# Altium project FDTI_USB_V1_1.PrjPcb
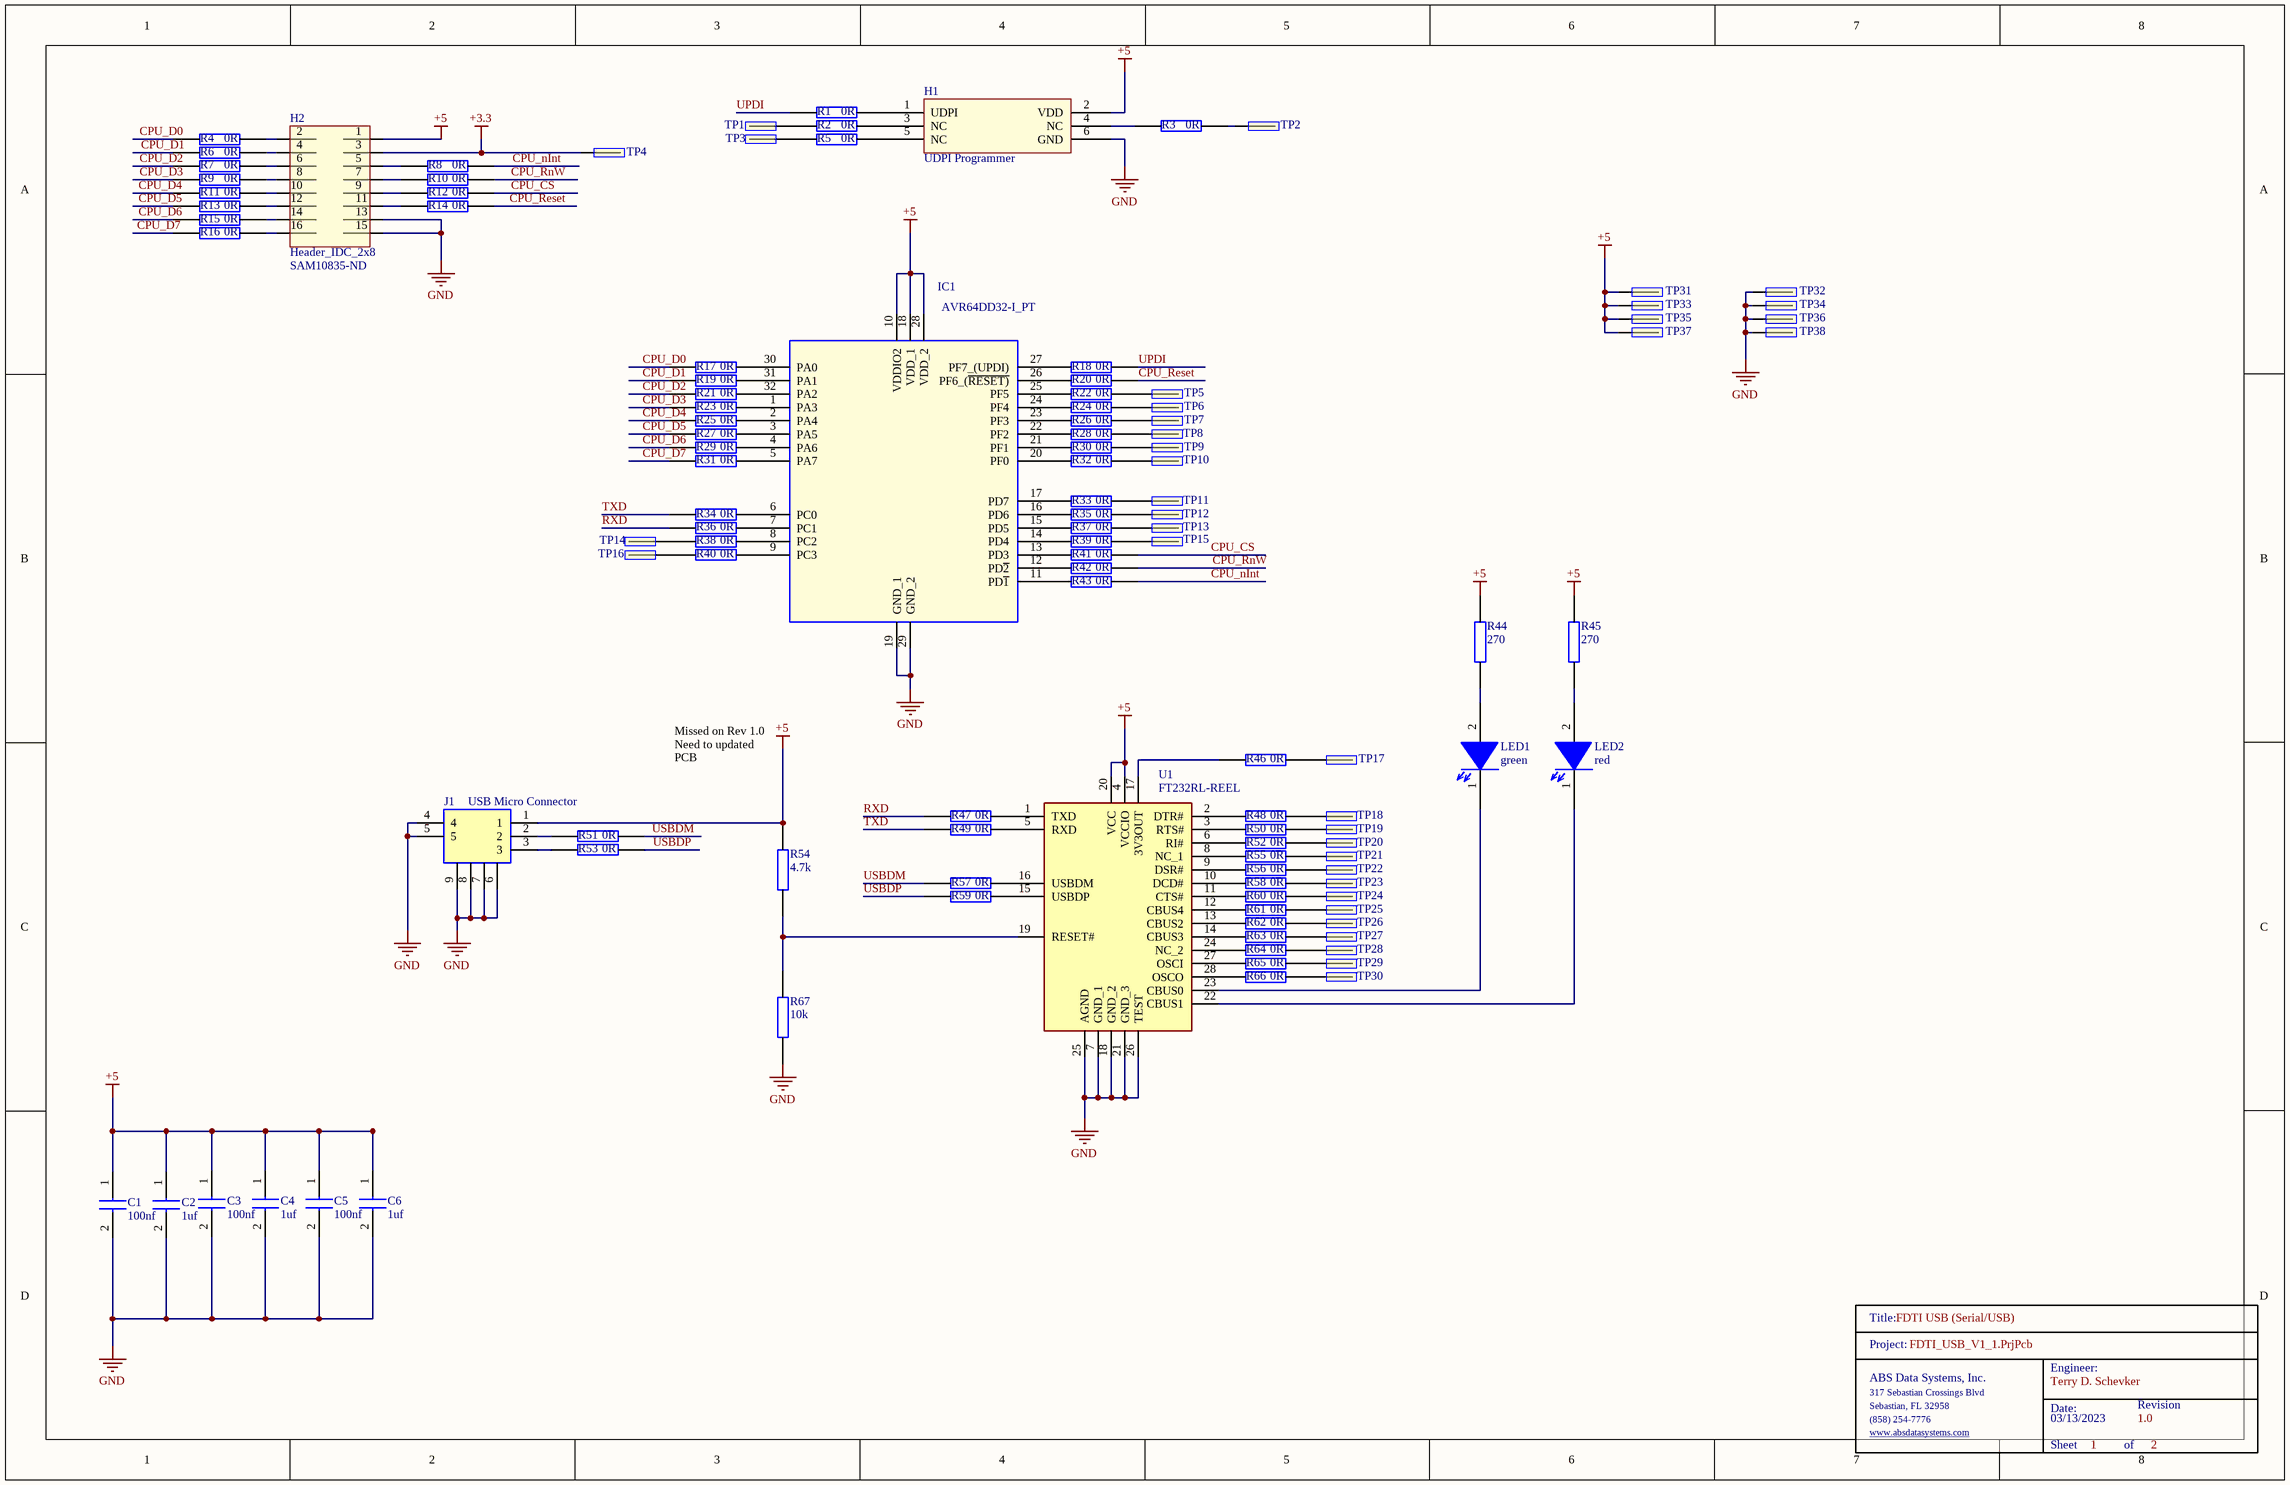
[diagram p0: FDTI_USB_Card.SchDoc]
2 sheets, 168 parts. Net scope: global (net labels, ports and power ports of the same name join across sheets).
Board file: FDTI_USB_PCB.PcbDoc
Sheets:
  FDTI_USB_Card.SchDoc
  FDTI_LED_Monitor.SchDoc

## Sheet FDTI_USB_Card.SchDoc: FDTI USB (Serial/USB)
size Tabloid; Date: 03/13/2023; Engineer: Terry D. Schevker; Revision: 1.0; SheetNumber: 1; SheetTotal: 2

### Parts
C1  100nf  [0603]
C2  1uf  [0603]
C3  100nf  [0603]
C4  1uf  [0603]
C5  100nf  [0603]
C6  1uf  [0603]
H1  UDPI Programmer  [HDR2X3]
H2  Header_IDC_2x8  Supplier Part Number 1: SAM10835-ND  [HEADER16]
IC1  AVR64DD32-I_PT  [QFP80P900X900X120-32N]
J1  USB Micro Connector  [1734035-2USB]
LED1  green  [0603_Diode]
LED2  red  [0603_Diode]
R1  0R  [0603]
R2  0R  [0603]
R3  0R  [0603]
R4  0R  [0603]
R5  0R  [0603]
R6  0R  [0603]
R7  0R  [0603]
R8  0R  [0603]
R9  0R  [0603]
R10  0R  [0603]
R11  0R  [0603]
R12  0R  [0603]
R13  0R  [0603]
R14  0R  [0603]
R15  0R  [0603]
R16  0R  [0603]
R17  0R  [0603]
R18  0R  [0603]
R19  0R  [0603]
R20  0R  [0603]
R21  0R  [0603]
R22  0R  [0603]
R23  0R  [0603]
R24  0R  [0603]
R25  0R  [0603]
R26  0R  [0603]
R27  0R  [0603]
R28  0R  [0603]
R29  0R  [0603]
R30  0R  [0603]
R31  0R  [0603]
R32  0R  [0603]
R33  0R  [0603]
R34  0R  [0603]
R35  0R  [0603]
R36  0R  [0603]
R37  0R  [0603]
R38  0R  [0603]
R39  0R  [0603]
R40  0R  [0603]
R41  0R  [0603]
R42  0R  [0603]
R43  0R  [0603]
R44  270  [0603]
R45  270  [0603]
R46  0R  [0603]
R47  0R  [0603]
R48  0R  [0603]
R49  0R  [0603]
R50  0R  [0603]
R51  0R  [0603]
R52  0R  [0603]
R53  0R  [0603]
R54  4.7k  [0603]
R55  0R  [0603]
R56  0R  [0603]
R57  0R  [0603]
R58  0R  [0603]
R59  0R  [0603]
R60  0R  [0603]
R61  0R  [0603]
R62  0R  [0603]
R63  0R  [0603]
R64  0R  [0603]
R65  0R  [0603]
R66  0R  [0603]
R67  10k  [0603]
TitleBlock_1  TitleBlock  (value not drawn)  (graphical)
TP1  TP  [TP]  (value not drawn)
TP2  TP  [TP]  (value not drawn)
TP3  TP  [TP]  (value not drawn)
TP4  TP  [TP]  (value not drawn)
TP5  TP  [TP]  (value not drawn)
TP6  TP  [TP]  (value not drawn)
TP7  TP  [TP]  (value not drawn)
TP8  TP  [TP]  (value not drawn)
TP9  TP  [TP]  (value not drawn)
TP10  TP  [TP]  (value not drawn)
TP11  TP  [TP]  (value not drawn)
TP12  TP  [TP]  (value not drawn)
TP13  TP  [TP]  (value not drawn)
TP14  TP  [TP]  (value not drawn)
TP15  TP  [TP]  (value not drawn)
TP16  TP  [TP]  (value not drawn)
TP17  TP  [TP]  (value not drawn)
TP18  TP  [TP]  (value not drawn)
TP19  TP  [TP]  (value not drawn)
TP20  TP  [TP]  (value not drawn)
TP21  TP  [TP]  (value not drawn)
TP22  TP  [TP]  (value not drawn)
TP23  TP  [TP]  (value not drawn)
TP24  TP  [TP]  (value not drawn)
TP25  TP  [TP]  (value not drawn)
TP26  TP  [TP]  (value not drawn)
TP27  TP  [TP]  (value not drawn)
TP28  TP  [TP]  (value not drawn)
TP29  TP  [TP]  (value not drawn)
TP30  TP  [TP]  (value not drawn)
TP31  TP  [TP]  (value not drawn)
TP32  TP  [TP]  (value not drawn)
TP33  TP  [TP]  (value not drawn)
TP34  TP  [TP]  (value not drawn)
TP35  TP  [TP]  (value not drawn)
TP36  TP  [TP]  (value not drawn)
TP37  TP  [TP]  (value not drawn)
TP38  TP  [TP]  (value not drawn)
U1  FT232RL-REEL  [SOIC-28_Narrow]

### Nets
+3.3: H2.3 TP4.1
+5: C1.1 C2.1 C3.1 C4.1 C5.1 C6.1 H1.2(VDD) H2.1 IC1.10(VDDIO2) IC1.18(VDD_1) IC1.28(VDD_2) J1.1 R44.2 R45.2 R54.2 TP31.1 TP33.1 TP35.1 TP37.1 U1.4(VCCIO) U1.20(VCC)
GND: C1.2 C2.2 C3.2 C4.2 C5.2 C6.2 H1.6(GND) H2.13 H2.15 IC1.19(GND_1) IC1.29(GND_2) J1.4 J1.5 J1.6(Shield) J1.7(Shield) J1.8(Shield) J1.9(Shield5) R67.1 TP32.1 TP34.1 TP36.1 TP38.1 U1.7(GND_1) U1.18(GND_2) U1.21(GND_3) U1.25(AGND) U1.26(TEST)
CPU_CS: R12.2 R41.2
CPU_D0: R4.1 R17.1
CPU_D1: R6.1 R19.1
CPU_D2: R7.1 R21.1
CPU_D3: R9.1 R23.1
CPU_D4: R11.1 R25.1
CPU_D5: R13.1 R27.1
CPU_D6: R15.1 R29.1
CPU_D7: R16.1 R31.1
CPU_nInt: R8.2 R43.2
CPU_Reset: R14.2 R20.2
CPU_RnW: R10.2 R42.2
RXD: R36.1 R47.1
TXD: R34.1 R49.1
UPDI: R1.1 R18.2
USBDM: R51.2 R57.1
USBDP: R53.2 R59.1
NetH1_1: H1.1(UDPI) R1.2
NetH1_3: H1.3(NC) R2.2
NetH1_4: H1.4(NC) R3.1
NetH1_5: H1.5(NC) R5.2
NetH2_2: H2.2 R4.2
NetH2_4: H2.4 R6.2
NetH2_5: H2.5 R8.1
NetH2_6: H2.6 R7.2
NetH2_7: H2.7 R10.1
NetH2_8: H2.8 R9.2
NetH2_9: H2.9 R12.1
NetH2_10: H2.10 R11.2
NetH2_11: H2.11 R14.1
NetH2_12: H2.12 R13.2
NetH2_14: H2.14 R15.2
NetH2_16: H2.16 R16.2
NetIC1_1: IC1.1(PA3) R23.2
NetIC1_2: IC1.2(PA4) R25.2
NetIC1_3: IC1.3(PA5) R27.2
NetIC1_4: IC1.4(PA6) R29.2
NetIC1_5: IC1.5(PA7) R31.2
NetIC1_6: IC1.6(PC0) R34.2
NetIC1_7: IC1.7(PC1) R36.2
NetIC1_8: IC1.8(PC2) R38.2
NetIC1_9: IC1.9(PC3) R40.2
NetIC1_11: IC1.11(PD~{1}) R43.1
NetIC1_12: IC1.12(PD~{2}) R42.1
NetIC1_13: IC1.13(PD3) R41.1
NetIC1_14: IC1.14(PD4) R39.1
NetIC1_15: IC1.15(PD5) R37.1
NetIC1_16: IC1.16(PD6) R35.1
NetIC1_17: IC1.17(PD7) R33.1
NetIC1_20: IC1.20(PF0) R32.1
NetIC1_21: IC1.21(PF1) R30.1
NetIC1_22: IC1.22(PF2) R28.1
NetIC1_23: IC1.23(PF3) R26.1
NetIC1_24: IC1.24(PF4) R24.1
NetIC1_25: IC1.25(PF5) R22.1
NetIC1_26: IC1.26(PF6_(~{RESET)}) R20.1
NetIC1_27: IC1.27(PF7_(UPDI)) R18.1
NetIC1_30: IC1.30(PA0) R17.2
NetIC1_31: IC1.31(PA1) R19.2
NetIC1_32: IC1.32(PA2) R21.2
NetJ1_2: J1.2 R51.1
NetJ1_3: J1.3 R53.1
NetLED1_1: LED1.1(K) U1.23(CBUS0)
NetLED1_2: LED1.2(A) R44.1
NetLED2_1: LED2.1(K) U1.22(CBUS1)
NetLED2_2: LED2.2(A) R45.1
NetR2_1: R2.1 TP1.1
NetR3_2: R3.2 TP2.1
NetR5_1: R5.1 TP3.1
NetR22_2: R22.2 TP5.1
NetR24_2: R24.2 TP6.1
NetR26_2: R26.2 TP7.1
NetR28_2: R28.2 TP8.1
NetR30_2: R30.2 TP9.1
NetR32_2: R32.2 TP10.1
NetR33_2: R33.2 TP11.1
NetR35_2: R35.2 TP12.1
NetR37_2: R37.2 TP13.1
NetR38_1: R38.1 TP14.1
NetR39_2: R39.2 TP15.1
NetR40_1: R40.1 TP16.1
NetR46_1: R46.1 U1.17(3V3OUT)
NetR46_2: R46.2 TP17.1
NetR47_2: R47.2 U1.1(TXD)
NetR48_1: R48.1 U1.2(DTR#)
NetR48_2: R48.2 TP18.1
NetR49_2: R49.2 U1.5(RXD)
NetR50_1: R50.1 U1.3(RTS#)
NetR50_2: R50.2 TP19.1
NetR52_1: R52.1 U1.6(RI#)
NetR52_2: R52.2 TP20.1
NetR54_1: R54.1 R67.2 U1.19(RESET#)
NetR55_1: R55.1 U1.8(NC_1)
NetR55_2: R55.2 TP21.1
NetR56_1: R56.1 U1.9(DSR#)
NetR56_2: R56.2 TP22.1
NetR57_2: R57.2 U1.16(USBDM)
NetR58_1: R58.1 U1.10(DCD#)
NetR58_2: R58.2 TP23.1
NetR59_2: R59.2 U1.15(USBDP)
NetR60_1: R60.1 U1.11(CTS#)
NetR60_2: R60.2 TP24.1
NetR61_1: R61.1 U1.12(CBUS4)
NetR61_2: R61.2 TP25.1
NetR62_1: R62.1 U1.13(CBUS2)
NetR62_2: R62.2 TP26.1
NetR63_1: R63.1 U1.14(CBUS3)
NetR63_2: R63.2 TP27.1
NetR64_1: R64.1 U1.24(NC_2)
NetR64_2: R64.2 TP28.1
NetR65_1: R65.1 U1.27(OSCI)
NetR65_2: R65.2 TP29.1
NetR66_1: R66.1 U1.28(OSCO)
NetR66_2: R66.2 TP30.1

### Notes on the sheet
- Missed on Rev 1.0
  Need to updated PCB
- (in symbol TitleBlock) Title:; Project:; Engineer:; ABS Data Systems, Inc.; 317 Sebastian Crossings Blvd; Sebastian, FL 32958; Date:; Revision; (858) 254-7776; www.absdatasystems.com; Sheet; of

### Library data of the parts
C1 C3 C5 = CL10B104JB8NNNC: Samsung Electro-Mechanics 0603 100nf
C2 C4 C6 = CL10B105KA8NNNL: Samsung Electro-Mechanics 0603 1uf
H1 = UDPI Programmer: 6 Pin 2X3 Through Hole Header
H2 = Header_IDC_2x8: 16 Pin 2x8 Through Hold IDC Connector; Manufacturer: Samtec; Manufacturer Part Number: TST-108-01-G-D; Number of Contacts: 16; Gender: Male; Connector Type: Male Pin; Pitch: 2.54mm; Row Spacing: 0.1inch; Supplier 1: Digi-Key; RoHS: Yes; Category: Headers and Wire Housings; Stock 1: 227; Pricing 1: 1=2.85000, 10=2.73600, 100=2.28000, 500=1.93800, 1000=1.65300, 5000=1.48200 (USD); Mount: Through Hole; Contact Plating: Gold; Contact Material: Bronze; Housing Material: Polyester; Housing Color: Black; Color: Black; Min Operating Temperature: -55°C; Max Operating Temperature: 125°C; Number of Rows: 2; Termination: Solder; Packaging: Rail/Tube; Orientation: Straight; Number of Positions: 16; Length: 27.94mm; Depth: 9.27mm; Contact Mating Length: 0.25inch; REACH SVHC: No SVHC; ComponentLink1URL: https://datasheet.ciiva.com/739/tst-mkt-739845.pdf?src-supplier=Digi-Key; ComponentLink1Description: https://datasheet.ciiva.com/739/tst-mkt-739845.pdf?src-supplier=Digi-Key; ComponentLink2URL: https://datasheet.ciiva.com/10018/htst-10018510.pdf?src-supplier=Avnet; ComponentLink2Description: https://datasheet.ciiva.com/10018/htst-10018510.pdf?src-supplier=Avnet
IC1 = AVR64DD32-I_PT: Integrated Circuit; Manufacturer_Name: Microchip; Manufacturer_Part_Number: AVR64DD32-I/PT | MULTI-VOLTAGE I/O; Datasheet Link: https://www.microchip.com/en-us/product/AVR64DD32; Height: 1.2mm
J1 = 1734035-4: USB Micro Connector SMD; Manufacturer_Name: TE Connectivity; Datasheet Link: https://componentsearchengine.com//1734035-4.pdf; Mouser2 Part Number: 571-1734035-4; Mouser2 Price/Stock: https://www.mouser.com/Search/Refine.aspx?Keyword=571-1734035-4; Manufacturer_Part_Number: 1734035-4
LED1 = 150060GS75000: Wurth Elektronik 0603 green; Manufacturer: Wurth Electronics; Wavelength: 520nm; Viewing Angle: 140°; Lens Style: Clear,Rectangular; Luminous Intensity: 430mcd; Forward Current: 30mA; Forward Voltage: 3.2V; Test Current: 20mA; Supplier 1: Digi-Key; Manufacturer Part Number: 150060GS75000; RoHS: Yes; Category: LEDs; Stock 1: 71509; Pricing 1: 1=0.14000, 50=0.13300, 100=0.11400, 500=0.09900 (USD); Mount: Surface Mount; Case/Package: 0603; Color: Green; Case Code (Metric): 1608; Case Code (Imperial): 0603; Min Operating Temperature: -40°C; Max Operating Temperature: 85°C; Package Quantity: 4000; Packaging: Tape and Reel; Dominant Wavelength: 520nm; Length: 1.6mm; Width: 0.8mm; Height: 0.7mm; REACH SVHC: Unknown; Lead Free: Lead Free; ComponentLink1URL: https://datasheet.ciiva.com/29562/150060gs75000-29562868.pdf?src-supplier=Digi-Key; ComponentLink1Description: https://datasheet.ciiva.com/29562/150060gs75000-29562868.pdf?src-supplier=Digi-Key; ComponentLink2URL: https://datasheet.ciiva.com/29279/759427-da-01-en-chipled-0603-w-kl-gruen-150060gs75000-29279201.pdf?src-supplier=Conrad; ComponentLink2Description: https://datasheet.ciiva.com/29279/759427-da-01-en-chipled-0603-w-kl-gruen-150060gs75000-29279201.pdf?src-supplier=Conrad; ComponentLink3URL: https://datasheet.ciiva.com/29562/150060gs75000-29562869.pdf?src-supplier=Digi-Key; ComponentLink3Description: https://datasheet.ciiva.com/29562/150060gs75000-29562869.pdf?src-supplier=Digi-Key; ComponentLink4URL: https://datasheet.ciiva.com/29562/150060gs75000-29562870.pdf?src-supplier=Digi-Key; ComponentLink4Description: https://datasheet.ciiva.com/29562/150060gs75000-29562870.pdf?src-supplier=Digi-Key
LED2 = 150060RS75000: Wurth Elektronik 0603 red; Manufacturer: Wurth Electronics; Manufacturer Part Number: 150060GS75000; Color: Green; Wavelength: 520nm; Viewing Angle: 140°; Lens Style: Clear,Rectangular; Luminous Intensity: 430mcd; Forward Current: 30mA; Forward Voltage: 3.2V; Test Current: 20mA; Supplier 1: Digi-Key; RoHS: Yes; Category: LEDs; Stock 1: 71509; Pricing 1: 1=0.14000, 50=0.13300, 100=0.11400, 500=0.09900 (USD); Mount: Surface Mount; Case/Package: 0603; Case Code (Metric): 1608; Case Code (Imperial): 0603; Min Operating Temperature: -40°C; Max Operating Temperature: 85°C; Package Quantity: 4000; Packaging: Tape and Reel; Dominant Wavelength: 520nm; Length: 1.6mm; Width: 0.8mm; Height: 0.7mm; REACH SVHC: Unknown; Lead Free: Lead Free; ComponentLink1URL: https://datasheet.ciiva.com/29562/150060gs75000-29562868.pdf?src-supplier=Digi-Key; ComponentLink1Description: https://datasheet.ciiva.com/29562/150060gs75000-29562868.pdf?src-supplier=Digi-Key; ComponentLink2URL: https://datasheet.ciiva.com/29279/759427-da-01-en-chipled-0603-w-kl-gruen-150060gs75000-29279201.pdf?src-supplier=Conrad; ComponentLink2Description: https://datasheet.ciiva.com/29279/759427-da-01-en-chipled-0603-w-kl-gruen-150060gs75000-29279201.pdf?src-supplier=Conrad; ComponentLink3URL: https://datasheet.ciiva.com/29562/150060gs75000-29562869.pdf?src-supplier=Digi-Key; ComponentLink3Description: https://datasheet.ciiva.com/29562/150060gs75000-29562869.pdf?src-supplier=Digi-Key; ComponentLink4URL: https://datasheet.ciiva.com/29562/150060gs75000-29562870.pdf?src-supplier=Digi-Key; ComponentLink4Description: https://datasheet.ciiva.com/29562/150060gs75000-29562870.pdf?src-supplier=Digi-Key
R1-R43 R46-R53 R55-R66 = RC0603JR-070RL: YAGEO 0603 0 ohm; Manufacturer_Name: KEMET; Geometry.Height: 0.55mm; Mouser Part Number: 603-RC0603JR-070RL; Mouser Price/Stock: https://www.mouser.co.uk/ProductDetail/YAGEO/RC0603JR-070RL?qs=2cAdsCoAWRGWyPcuXgGiXQ%3D%3D; Manufacturer_Part_Number: RC0603JR-070RL; Datasheet Link: https://datasheet.datasheetarchive.com/originals/distributors/Datasheets_SAMA/902f9e387b938f871d31120f5fc1d65e.pdf
R44 R45 = RC0603JR-07270RL: YAGEO 0603 270 ohm; Manufacturer_Name: KEMET; Manufacturer_Part_Number: RC0603JR-070RL; Geometry.Height: 0.55mm; Mouser Part Number: 603-RC0603JR-070RL; Mouser Price/Stock: https://www.mouser.co.uk/ProductDetail/YAGEO/RC0603JR-070RL?qs=2cAdsCoAWRGWyPcuXgGiXQ%3D%3D; Datasheet Link: https://datasheet.datasheetarchive.com/originals/distributors/Datasheets_SAMA/902f9e387b938f871d31120f5fc1d65e.pdf
R54 = RC0603FR-104K7L: YAGEO 0603 4.7k; Manufacturer_Name: KEMET; Manufacturer_Part_Number: RC0603JR-070RL; Geometry.Height: 0.55mm; Mouser Part Number: 603-RC0603JR-070RL; Mouser Price/Stock: https://www.mouser.co.uk/ProductDetail/YAGEO/RC0603JR-070RL?qs=2cAdsCoAWRGWyPcuXgGiXQ%3D%3D; Datasheet Link: https://datasheet.datasheetarchive.com/originals/distributors/Datasheets_SAMA/902f9e387b938f871d31120f5fc1d65e.pdf
R67 = RC0603JR-0710KL: YAGEO 0603 10k ohm; Manufacturer_Name: KEMET; Manufacturer_Part_Number: RC0603JR-070RL; Geometry.Height: 0.55mm; Mouser Part Number: 603-RC0603JR-070RL; Mouser Price/Stock: https://www.mouser.co.uk/ProductDetail/YAGEO/RC0603JR-070RL?qs=2cAdsCoAWRGWyPcuXgGiXQ%3D%3D; Datasheet Link: https://datasheet.datasheetarchive.com/originals/distributors/Datasheets_SAMA/902f9e387b938f871d31120f5fc1d65e.pdf
TP1-TP38 = TP: Manufacturer: Samtec; Manufacturer Part Number: TST-105-01-G-D; Number of Contacts: 16; Gender: Male; Connector Type: Male Pin; Pitch: 2.54mm; Row Spacing: 0.1inch; Supplier 1: Digi-Key; RoHS: Yes; Category: Headers and Wire Housings; Stock 1: 227; Pricing 1: 1=2.85000, 10=2.73600, 100=2.28000, 500=1.93800, 1000=1.65300, 5000=1.48200 (USD); Mount: Through Hole; Contact Plating: Gold; Contact Material: Bronze; Housing Material: Polyester; Housing Color: Black; Color: Black; Min Operating Temperature: -55°C; Max Operating Temperature: 125°C; Number of Rows: 2; Termination: Solder; Packaging: Rail/Tube; Orientation: Straight; Number of Positions: 16; Length: 27.94mm; Depth: 9.27mm; Contact Mating Length: 0.25inch; REACH SVHC: No SVHC; ComponentLink1URL: https://datasheet.ciiva.com/739/tst-mkt-739845.pdf?src-supplier=Digi-Key; ComponentLink1Description: https://datasheet.ciiva.com/739/tst-mkt-739845.pdf?src-supplier=Digi-Key; ComponentLink2URL: https://datasheet.ciiva.com/10018/htst-10018510.pdf?src-supplier=Avnet; ComponentLink2Description: https://datasheet.ciiva.com/10018/htst-10018510.pdf?src-supplier=Avnet
U1 = FT232RL-REEL: USB-Serial SMD; Manufacturer_Name: FTDI Chip; Datasheet Link: http://www.ftdichip.com/Support/Documents/DataSheets/ICs/DS_FT232R.pdf; Height: 2mm; Manufacturer_Part_Number: FT232RL-REEL

## Sheet FDTI_LED_Monitor.SchDoc: FDTI Serial LED Monitor
size Tabloid; Date: 05/10/2023; Engineer: Terry D. Schevler; Revision: 1.0; SheetNumber: 2; SheetTotal: 2
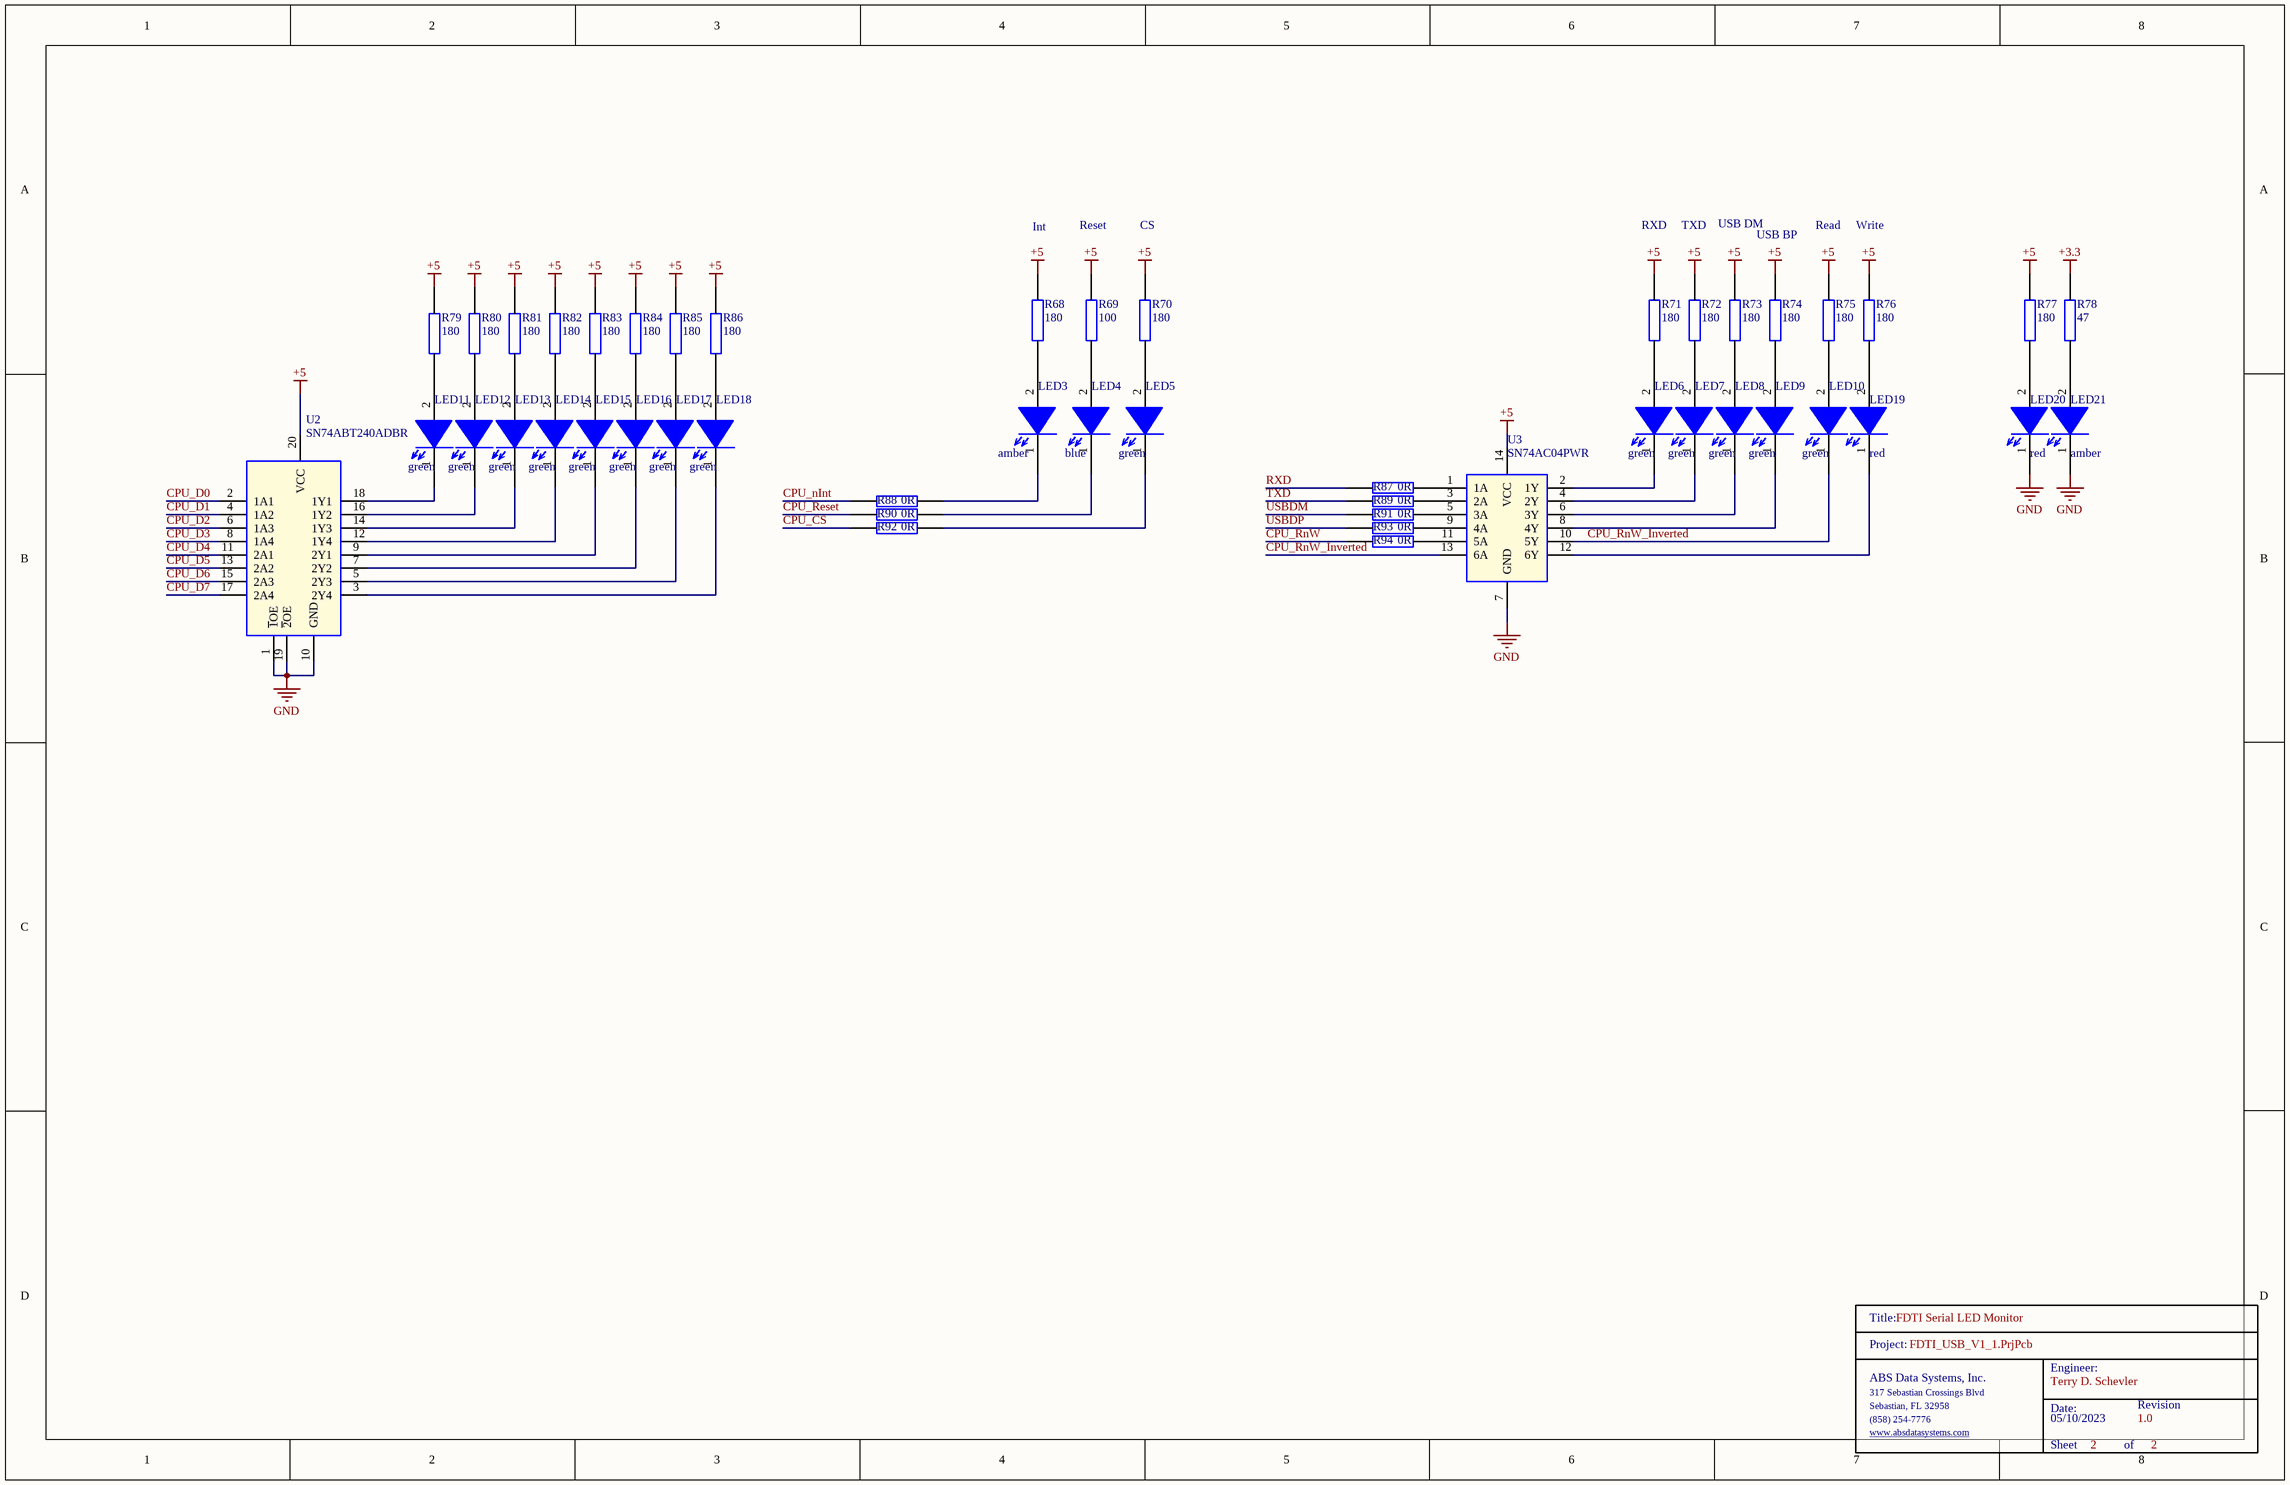
[diagram p1: FDTI_LED_Monitor.SchDoc]

### Parts
LED3  amber  [0603_Diode]
LED4  blue  [0603_Diode]
LED5  green  [0603_Diode]
LED6  green  [0603_Diode]
LED7  green  [0603_Diode]
LED8  green  [0603_Diode]
LED9  green  [0603_Diode]
LED10  green  [0603_Diode]
LED11  green  [0603_Diode]
LED12  green  [0603_Diode]
LED13  green  [0603_Diode]
LED14  green  [0603_Diode]
LED15  green  [0603_Diode]
LED16  green  [0603_Diode]
LED17  green  [0603_Diode]
LED18  green  [0603_Diode]
LED19  red  [0603_Diode]
LED20  red  [0603_Diode]
LED21  amber  [0603_Diode]
R68  180  [0603]
R69  100  [0603]
R70  180  [0603]
R71  180  [0603]
R72  180  [0603]
R73  180  [0603]
R74  180  [0603]
R75  180  [0603]
R76  180  [0603]
R77  180  [0603]
R78  47  [0603]
R79  180  [0603]
R80  180  [0603]
R81  180  [0603]
R82  180  [0603]
R83  180  [0603]
R84  180  [0603]
R85  180  [0603]
R86  180  [0603]
R87  0R  [0603]
R88  0R  [0603]
R89  0R  [0603]
R90  0R  [0603]
R91  0R  [0603]
R92  0R  [0603]
R93  0R  [0603]
R94  0R  [0603]
TitleBlock_2  TitleBlock  (value not drawn)  (graphical)
U2  SN74ABT240ADBR  [SOP65P780X200-20N]
U3  SN74AC04PWR  [SOP65P640X120-14N]

### Nets
+3.3: R78.1
+5: R68.2 R69.1 R70.2 R71.2 R72.2 R73.2 R74.2 R75.2 R76.2 R77.2 R79.2 R80.2 R81.2 R82.2 R83.2 R84.2 R85.2 R86.2 U2.20(VCC) U3.14(VCC)
GND: LED20.1(K) LED21.1(K) U2.1(~{1}OE) U2.10(GND) U2.19(~{2}OE) U3.7(GND)
CPU_CS: R92.1
CPU_D0: U2.2(1A1)
CPU_D1: U2.4(1A2)
CPU_D2: U2.6(1A3)
CPU_D3: U2.8(1A4)
CPU_D4: U2.11(2A1)
CPU_D5: U2.13(2A2)
CPU_D6: U2.15(2A3)
CPU_D7: U2.17(2A4)
CPU_nInt: R88.1
CPU_Reset: R90.1
CPU_RnW: R94.1
CPU_RnW_Inverted: LED10.1(K) U3.10(5Y) U3.13(6A)
RXD: R87.1
TXD: R89.1
USBDM: R91.1
USBDP: R93.1
NetLED3_1: LED3.1(K) R88.2
NetLED3_2: LED3.2(A) R68.1
NetLED4_1: LED4.1(K) R90.2
NetLED4_2: LED4.2(A) R69.2
NetLED5_1: LED5.1(K) R92.2
NetLED5_2: LED5.2(A) R70.1
NetLED6_1: LED6.1(K) U3.2(1Y)
NetLED6_2: LED6.2(A) R71.1
NetLED7_1: LED7.1(K) U3.4(2Y)
NetLED7_2: LED7.2(A) R72.1
NetLED8_1: LED8.1(K) U3.6(3Y)
NetLED8_2: LED8.2(A) R73.1
NetLED9_1: LED9.1(K) U3.8(4Y)
NetLED9_2: LED9.2(A) R74.1
NetLED10_2: LED10.2(A) R75.1
NetLED11_1: LED11.1(K) U2.18(1Y1)
NetLED11_2: LED11.2(A) R79.1
NetLED12_1: LED12.1(K) U2.16(1Y2)
NetLED12_2: LED12.2(A) R80.1
NetLED13_1: LED13.1(K) U2.14(1Y3)
NetLED13_2: LED13.2(A) R81.1
NetLED14_1: LED14.1(K) U2.12(1Y4)
NetLED14_2: LED14.2(A) R82.1
NetLED15_1: LED15.1(K) U2.9(2Y1)
NetLED15_2: LED15.2(A) R83.1
NetLED16_1: LED16.1(K) U2.7(2Y2)
NetLED16_2: LED16.2(A) R84.1
NetLED17_1: LED17.1(K) U2.5(2Y3)
NetLED17_2: LED17.2(A) R85.1
NetLED18_1: LED18.1(K) U2.3(2Y4)
NetLED18_2: LED18.2(A) R86.1
NetLED19_1: LED19.1(K) U3.12(6Y)
NetLED19_2: LED19.2(A) R76.1
NetLED20_2: LED20.2(A) R77.1
NetLED21_2: LED21.2(A) R78.2
NetR87_2: R87.2 U3.1(1A)
NetR89_2: R89.2 U3.3(2A)
NetR91_2: R91.2 U3.5(3A)
NetR93_2: R93.2 U3.9(4A)
NetR94_2: R94.2 U3.11(5A)

### Notes on the sheet
- Int
- Reset
- CS
- RXD
- TXD
- USB DM
- Read
- Write
- USB BP
- (in symbol TitleBlock) Title:; Project:; Engineer:; ABS Data Systems, Inc.; 317 Sebastian Crossings Blvd; Sebastian, FL 32958; Date:; Revision; (858) 254-7776; www.absdatasystems.com; Sheet; of

### Library data of the parts
LED3 LED21 = 150060AS75000: Wurth Elektronik 0603 amber; Manufacturer: Wurth Electronics; Manufacturer Part Number: 150060GS75000; Color: Green; Wavelength: 520nm; Viewing Angle: 140°; Lens Style: Clear,Rectangular; Luminous Intensity: 430mcd; Forward Current: 30mA; Forward Voltage: 3.2V; Test Current: 20mA; Supplier 1: Digi-Key; RoHS: Yes; Category: LEDs; Stock 1: 71509; Pricing 1: 1=0.14000, 50=0.13300, 100=0.11400, 500=0.09900 (USD); Mount: Surface Mount; Case/Package: 0603; Case Code (Metric): 1608; Case Code (Imperial): 0603; Min Operating Temperature: -40°C; Max Operating Temperature: 85°C; Package Quantity: 4000; Packaging: Tape and Reel; Dominant Wavelength: 520nm; Length: 1.6mm; Width: 0.8mm; Height: 0.7mm; REACH SVHC: Unknown; Lead Free: Lead Free; ComponentLink1URL: https://datasheet.ciiva.com/29562/150060gs75000-29562868.pdf?src-supplier=Digi-Key; ComponentLink1Description: https://datasheet.ciiva.com/29562/150060gs75000-29562868.pdf?src-supplier=Digi-Key; ComponentLink2URL: https://datasheet.ciiva.com/29279/759427-da-01-en-chipled-0603-w-kl-gruen-150060gs75000-29279201.pdf?src-supplier=Conrad; ComponentLink2Description: https://datasheet.ciiva.com/29279/759427-da-01-en-chipled-0603-w-kl-gruen-150060gs75000-29279201.pdf?src-supplier=Conrad; ComponentLink3URL: https://datasheet.ciiva.com/29562/150060gs75000-29562869.pdf?src-supplier=Digi-Key; ComponentLink3Description: https://datasheet.ciiva.com/29562/150060gs75000-29562869.pdf?src-supplier=Digi-Key; ComponentLink4URL: https://datasheet.ciiva.com/29562/150060gs75000-29562870.pdf?src-supplier=Digi-Key; ComponentLink4Description: https://datasheet.ciiva.com/29562/150060gs75000-29562870.pdf?src-supplier=Digi-Key
LED4 = 150060BS75000: Wurth Elektronik 0603 blue; Manufacturer: Wurth Electronics; Manufacturer Part Number: 150060GS75000; Color: Green; Wavelength: 520nm; Viewing Angle: 140°; Lens Style: Clear,Rectangular; Luminous Intensity: 430mcd; Forward Current: 30mA; Forward Voltage: 3.2V; Test Current: 20mA; Supplier 1: Digi-Key; RoHS: Yes; Category: LEDs; Stock 1: 71509; Pricing 1: 1=0.14000, 50=0.13300, 100=0.11400, 500=0.09900 (USD); Mount: Surface Mount; Case/Package: 0603; Case Code (Metric): 1608; Case Code (Imperial): 0603; Min Operating Temperature: -40°C; Max Operating Temperature: 85°C; Package Quantity: 4000; Packaging: Tape and Reel; Dominant Wavelength: 520nm; Length: 1.6mm; Width: 0.8mm; Height: 0.7mm; REACH SVHC: Unknown; Lead Free: Lead Free; ComponentLink1URL: https://datasheet.ciiva.com/29562/150060gs75000-29562868.pdf?src-supplier=Digi-Key; ComponentLink1Description: https://datasheet.ciiva.com/29562/150060gs75000-29562868.pdf?src-supplier=Digi-Key; ComponentLink2URL: https://datasheet.ciiva.com/29279/759427-da-01-en-chipled-0603-w-kl-gruen-150060gs75000-29279201.pdf?src-supplier=Conrad; ComponentLink2Description: https://datasheet.ciiva.com/29279/759427-da-01-en-chipled-0603-w-kl-gruen-150060gs75000-29279201.pdf?src-supplier=Conrad; ComponentLink3URL: https://datasheet.ciiva.com/29562/150060gs75000-29562869.pdf?src-supplier=Digi-Key; ComponentLink3Description: https://datasheet.ciiva.com/29562/150060gs75000-29562869.pdf?src-supplier=Digi-Key; ComponentLink4URL: https://datasheet.ciiva.com/29562/150060gs75000-29562870.pdf?src-supplier=Digi-Key; ComponentLink4Description: https://datasheet.ciiva.com/29562/150060gs75000-29562870.pdf?src-supplier=Digi-Key
LED5-LED18 = 150060GS75000: as LED1 on sheet FDTI_USB_Card; Supplier 1: Digi-Key; Manufacturer Part Number: 150060GS75000; RoHS: Yes; Category: LEDs; Stock 1: 71509; Pricing 1: 1=0.14000, 50=0.13300, 100=0.11400, 500=0.09900 (USD); Mount: Surface Mount; Case/Package: 0603; Color: Green; Case Code (Metric): 1608; Case Code (Imperial): 0603; Min Operating Temperature: -40°C; Max Operating Temperature: 85°C; Package Quantity: 4000; Packaging: Tape and Reel; Dominant Wavelength: 520nm; Length: 1.6mm; Width: 0.8mm; Height: 0.7mm; REACH SVHC: Unknown; Lead Free: Lead Free; ComponentLink1URL: https://datasheet.ciiva.com/29562/150060gs75000-29562868.pdf?src-supplier=Digi-Key; ComponentLink1Description: https://datasheet.ciiva.com/29562/150060gs75000-29562868.pdf?src-supplier=Digi-Key; ComponentLink2URL: https://datasheet.ciiva.com/29279/759427-da-01-en-chipled-0603-w-kl-gruen-150060gs75000-29279201.pdf?src-supplier=Conrad; ComponentLink2Description: https://datasheet.ciiva.com/29279/759427-da-01-en-chipled-0603-w-kl-gruen-150060gs75000-29279201.pdf?src-supplier=Conrad; ComponentLink3URL: https://datasheet.ciiva.com/29562/150060gs75000-29562869.pdf?src-supplier=Digi-Key; ComponentLink3Description: https://datasheet.ciiva.com/29562/150060gs75000-29562869.pdf?src-supplier=Digi-Key; ComponentLink4URL: https://datasheet.ciiva.com/29562/150060gs75000-29562870.pdf?src-supplier=Digi-Key; ComponentLink4Description: https://datasheet.ciiva.com/29562/150060gs75000-29562870.pdf?src-supplier=Digi-Key
LED19 LED20 = 150060RS75000: as LED2 on sheet FDTI_USB_Card; Supplier 1: Digi-Key; RoHS: Yes; Category: LEDs; Stock 1: 71509; Pricing 1: 1=0.14000, 50=0.13300, 100=0.11400, 500=0.09900 (USD); Mount: Surface Mount; Case/Package: 0603; Case Code (Metric): 1608; Case Code (Imperial): 0603; Min Operating Temperature: -40°C; Max Operating Temperature: 85°C; Package Quantity: 4000; Packaging: Tape and Reel; Dominant Wavelength: 520nm; Length: 1.6mm; Width: 0.8mm; Height: 0.7mm; REACH SVHC: Unknown; Lead Free: Lead Free; ComponentLink1URL: https://datasheet.ciiva.com/29562/150060gs75000-29562868.pdf?src-supplier=Digi-Key; ComponentLink1Description: https://datasheet.ciiva.com/29562/150060gs75000-29562868.pdf?src-supplier=Digi-Key; ComponentLink2URL: https://datasheet.ciiva.com/29279/759427-da-01-en-chipled-0603-w-kl-gruen-150060gs75000-29279201.pdf?src-supplier=Conrad; ComponentLink2Description: https://datasheet.ciiva.com/29279/759427-da-01-en-chipled-0603-w-kl-gruen-150060gs75000-29279201.pdf?src-supplier=Conrad; ComponentLink3URL: https://datasheet.ciiva.com/29562/150060gs75000-29562869.pdf?src-supplier=Digi-Key; ComponentLink3Description: https://datasheet.ciiva.com/29562/150060gs75000-29562869.pdf?src-supplier=Digi-Key; ComponentLink4URL: https://datasheet.ciiva.com/29562/150060gs75000-29562870.pdf?src-supplier=Digi-Key; ComponentLink4Description: https://datasheet.ciiva.com/29562/150060gs75000-29562870.pdf?src-supplier=Digi-Key
R68 R70-R77 R79-R86 = RC0603FR-13180RL: YAGEO 0603 180 ohm; Manufacturer_Name: KEMET; Manufacturer_Part_Number: RC0603JR-070RL; Geometry.Height: 0.55mm; Mouser Part Number: 603-RC0603JR-070RL; Mouser Price/Stock: https://www.mouser.co.uk/ProductDetail/YAGEO/RC0603JR-070RL?qs=2cAdsCoAWRGWyPcuXgGiXQ%3D%3D; Datasheet Link: https://datasheet.datasheetarchive.com/originals/distributors/Datasheets_SAMA/902f9e387b938f871d31120f5fc1d65e.pdf
R69 = RC0603FR-10100RL: YAGEO 0603 100 ohm; Manufacturer_Name: KEMET; Manufacturer_Part_Number: RC0603JR-070RL; Geometry.Height: 0.55mm; Mouser Part Number: 603-RC0603JR-070RL; Mouser Price/Stock: https://www.mouser.co.uk/ProductDetail/YAGEO/RC0603JR-070RL?qs=2cAdsCoAWRGWyPcuXgGiXQ%3D%3D; Datasheet Link: https://datasheet.datasheetarchive.com/originals/distributors/Datasheets_SAMA/902f9e387b938f871d31120f5fc1d65e.pdf
R78 = RC0603FR-0747KL: YAGEO 0603 47; Manufacturer_Name: KEMET; Manufacturer_Part_Number: RC0603JR-070RL; Geometry.Height: 0.55mm; Mouser Part Number: 603-RC0603JR-070RL; Mouser Price/Stock: https://www.mouser.co.uk/ProductDetail/YAGEO/RC0603JR-070RL?qs=2cAdsCoAWRGWyPcuXgGiXQ%3D%3D; Datasheet Link: https://datasheet.datasheetarchive.com/originals/distributors/Datasheets_SAMA/902f9e387b938f871d31120f5fc1d65e.pdf
R87-R94 = RC0603JR-070RL: as R1 on sheet FDTI_USB_Card; Mouser Part Number: 603-RC0603JR-070RL; Mouser Price/Stock: https://www.mouser.co.uk/ProductDetail/YAGEO/RC0603JR-070RL?qs=2cAdsCoAWRGWyPcuXgGiXQ%3D%3D; Manufacturer_Part_Number: RC0603JR-070RL; Datasheet Link: https://datasheet.datasheetarchive.com/originals/distributors/Datasheets_SAMA/902f9e387b938f871d31120f5fc1d65e.pdf
U2 = SN74ABT240ADBR: Octal Buffers/Drivers With 3-State Outputs; Manufacturer_Name: Texas Instruments; Geometry.Height: 2mm; Mouser Part Number: 595-SN74ABT240ADBR; Mouser Price/Stock: https://www.mouser.co.uk/ProductDetail/Texas-Instruments/SN74ABT240ADBR?qs=JHHQeKcAU3Dt82k%252BVyiYdw%3D%3D; Manufacturer_Part_Number: SN74ABT240ADBR; Datasheet Link: http://www.ti.com/lit/gpn/sn74abt240a
U3 = SN74AC04PWR: Hex Inverters; Manufacturer_Name: Texas Instruments; Geometry.Height: 1.2mm; Mouser Part Number: 595-SN74AC04PWR; Mouser Price/Stock: https://www.mouser.co.uk/ProductDetail/Texas-Instruments/SN74AC04PWR?qs=RZS%252BpEsUn7pRvPNqsga4SA%3D%3D; Manufacturer_Part_Number: SN74AC04PWR; Datasheet Link: http://www.ti.com/lit/gpn/sn74ac04

## Nets that join several sheets
+3.3: FDTI_USB_Card (H2.3 TP4.1), FDTI_LED_Monitor (R78.1)
+5: FDTI_USB_Card (21 pins), FDTI_LED_Monitor (20 pins)
GND: FDTI_USB_Card (27 pins), FDTI_LED_Monitor (6 pins)
CPU_CS: FDTI_USB_Card (R12.2 R41.2), FDTI_LED_Monitor (R92.1)
CPU_D0: FDTI_USB_Card (R4.1 R17.1), FDTI_LED_Monitor (U2.2)
CPU_D1: FDTI_USB_Card (R6.1 R19.1), FDTI_LED_Monitor (U2.4)
CPU_D2: FDTI_USB_Card (R7.1 R21.1), FDTI_LED_Monitor (U2.6)
CPU_D3: FDTI_USB_Card (R9.1 R23.1), FDTI_LED_Monitor (U2.8)
CPU_D4: FDTI_USB_Card (R11.1 R25.1), FDTI_LED_Monitor (U2.11)
CPU_D5: FDTI_USB_Card (R13.1 R27.1), FDTI_LED_Monitor (U2.13)
CPU_D6: FDTI_USB_Card (R15.1 R29.1), FDTI_LED_Monitor (U2.15)
CPU_D7: FDTI_USB_Card (R16.1 R31.1), FDTI_LED_Monitor (U2.17)
CPU_nInt: FDTI_USB_Card (R8.2 R43.2), FDTI_LED_Monitor (R88.1)
CPU_Reset: FDTI_USB_Card (R14.2 R20.2), FDTI_LED_Monitor (R90.1)
CPU_RnW: FDTI_USB_Card (R10.2 R42.2), FDTI_LED_Monitor (R94.1)
RXD: FDTI_USB_Card (R36.1 R47.1), FDTI_LED_Monitor (R87.1)
TXD: FDTI_USB_Card (R34.1 R49.1), FDTI_LED_Monitor (R89.1)
USBDM: FDTI_USB_Card (R51.2 R57.1), FDTI_LED_Monitor (R91.1)
USBDP: FDTI_USB_Card (R53.2 R59.1), FDTI_LED_Monitor (R93.1)